# EAGLE design ttl-bob (EAGLE 6.4)
DATABASE: ../../lbr/part-db/parts-db.txt
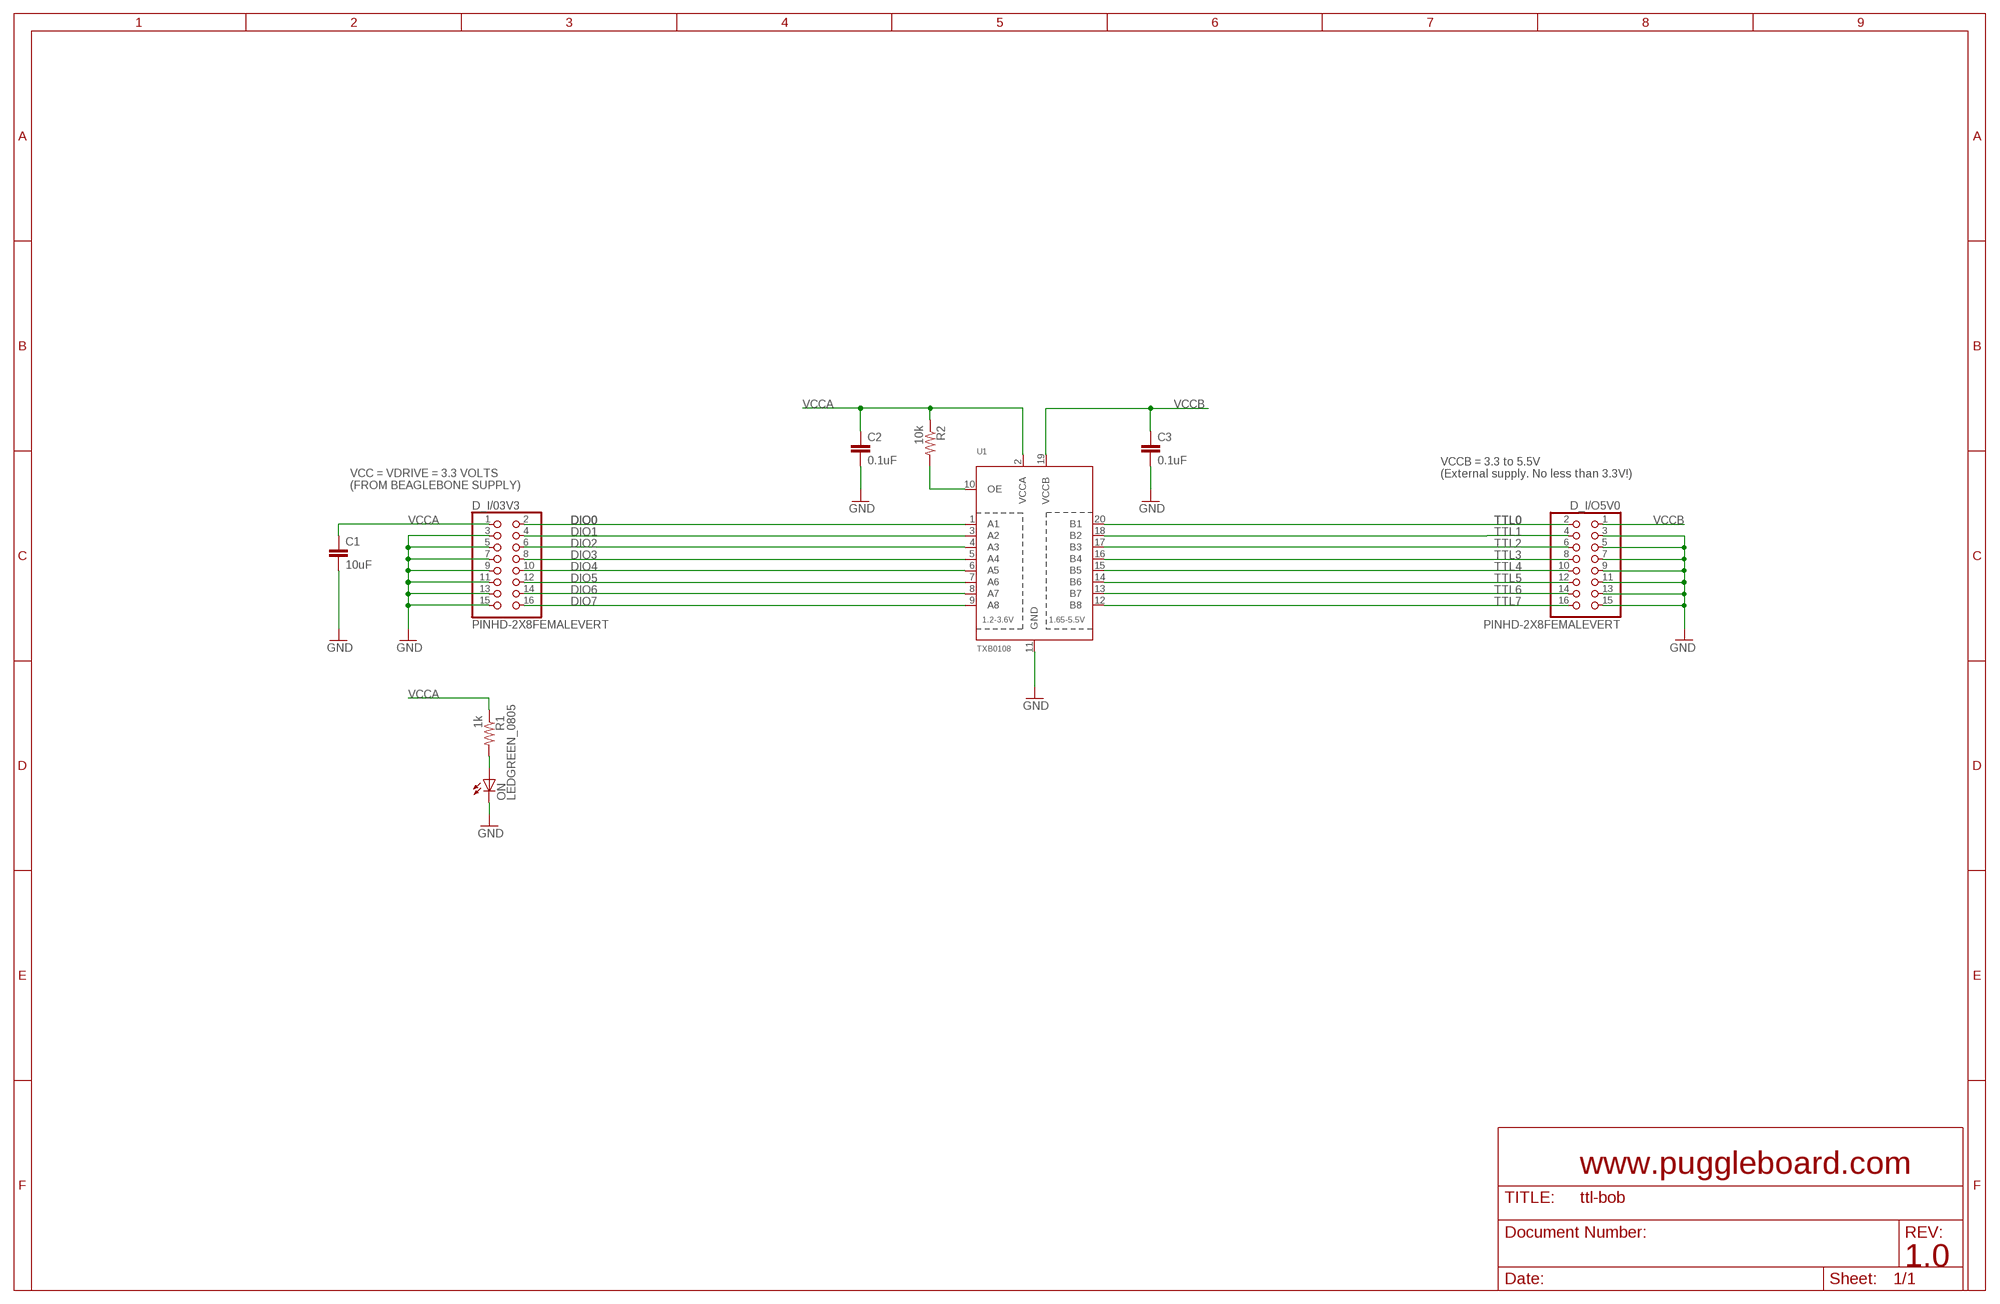
[diagram p0: schematic, sheet 1]

## Parts
C1  10uF  C_0805  [0805]
C2  0.1uF  C_0603  [0603]
C3  0.1uF  C_0603  [0603]
D_I/03V3  PINHD-2X8FEMALEVERT  [2X08]
D_I/O5V0  PINHD-2X8FEMALEVERT  [2X08]
ON  LEDGREEN_0805  [CHIP-LED0805]
R1  1k  R_0603  [0603]
R2  10k  R_0603  [0603]
U1  TXB0108  TXB0108PWR  [TSSOP20]

## Nets
DIO0: D_I/03V3.2 U1.1(A1)
DIO1: D_I/03V3.4 U1.3(A2)
DIO2: D_I/03V3.6 U1.4(A3)
DIO3: D_I/03V3.8 U1.5(A4)
DIO4: D_I/03V3.10 U1.6(A5)
DIO5: D_I/03V3.12 U1.7(A6)
DIO6: D_I/03V3.14 U1.8(A7)
DIO7: D_I/03V3.16 U1.9(A8)
GND [gnd]: C1.2 C2.2 C3.2 D_I/03V3.3 D_I/03V3.5 D_I/03V3.7 D_I/03V3.9 D_I/03V3.11 D_I/03V3.13 D_I/03V3.15 D_I/O5V0.3 D_I/O5V0.5 D_I/O5V0.7 D_I/O5V0.9 D_I/O5V0.11 D_I/O5V0.13 D_I/O5V0.15 ON.C U1.11(GND)
N$7: R2.2 U1.10(OE)
N$9: ON.A R1.2
TTL0: D_I/O5V0.2 U1.20(B1)
TTL1: D_I/O5V0.4 U1.18(B2)
TTL2: D_I/O5V0.6 U1.17(B3)
TTL3: D_I/O5V0.8 U1.16(B4)
TTL4: D_I/O5V0.10 U1.15(B5)
TTL5: D_I/O5V0.12 U1.14(B6)
TTL6: D_I/O5V0.14 U1.13(B7)
TTL7: D_I/O5V0.16 U1.12(B8)
VCCA [supply]: C1.1 C2.1 D_I/03V3.1 R1.1 R2.1 U1.2(VCCA)
VCCB [supply]: C3.1 D_I/O5V0.1 U1.19(VCCB)

## Notes on the sheet
- VCCB = 3.3 to 5.5V
  (External supply. No less than 3.3V!)
- VCC = VDRIVE = 3.3 VOLTS 
  (FROM BEAGLEBONE SUPPLY)
- www.puggleboard.com
- 1.0

## Library data of the parts
C1 = puggleboard:C: Capacitor; MN: TDK Corp.; PARTNO: C2012X5R1Cxxxxxxx; VID: DK
C2 C3 = puggleboard:C: Capacitor
D_I/03V3 D_I/O5V0 = puggleboard:PINHD-2X8; DK: S7111-ND; MN: Sullins; MPN: PPPC082LFBN-RC
ON = puggleboard:LED; DK: 350-2044-1-ND; MN: 598-8170-107F; MPN: Dialight
R1 = puggleboard:R: Resistor; DK: P1.00KHCT-ND; MN: Panasonic; MPN: ERJ-3EKF1001V
R2 = puggleboard:R: Resistor; DK: P10.0KHCT-ND; MN: Panasonic; MPN: ERJ-3EKF1002V
U1 = puggleboard:TXB0108PWR: 8-Bit Bi-Directional Level Shifter 1.2V-3.6V (VCCA) to 1.65V-5.5V (VCCB) bi-directional level shifter with auto direction sensing. Max data rate - VCCA 1.8V: 20Mbps (50ns), VCCA 3.3V: 100Mbps (10ns) Digikey: 296-21527-1-ND; DK: 296-21527-1-ND; MN: Texas Instruments; MPN: TXB0108PWR

## Net classes
1 supply: width 0.254 mm
2 diffpair: width 0.178 mm
3 gnd: width 0.254 mm

## Board
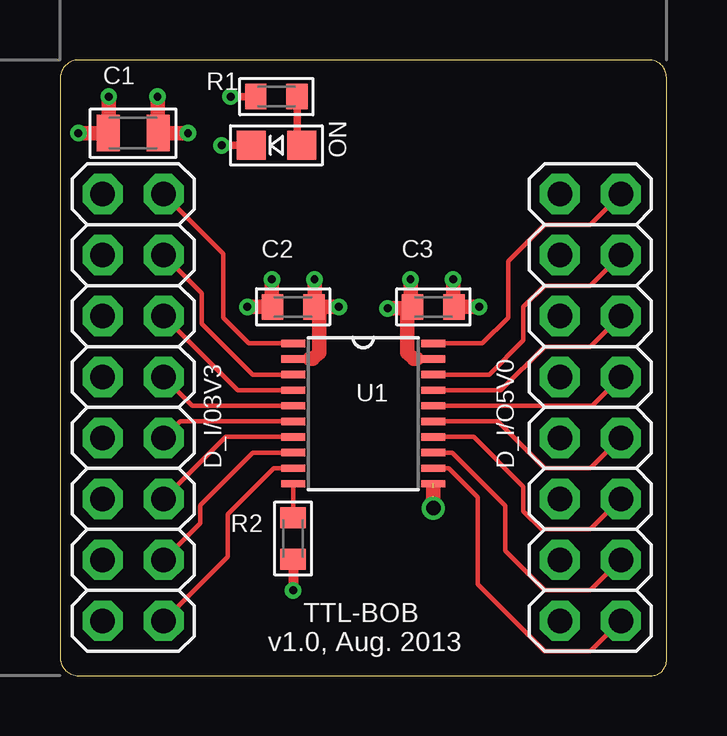
[diagram p1: board, top side]
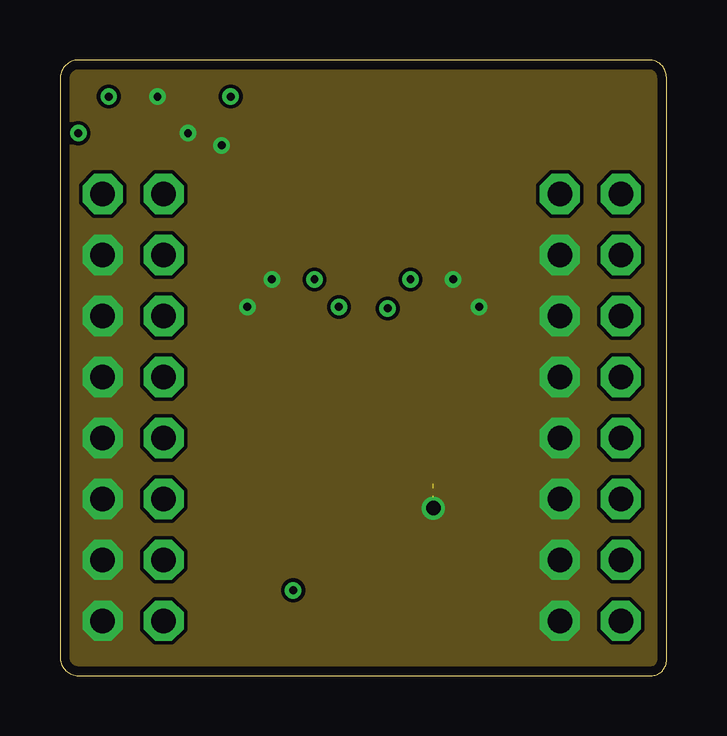
[diagram p2: board, inner layer Ground]
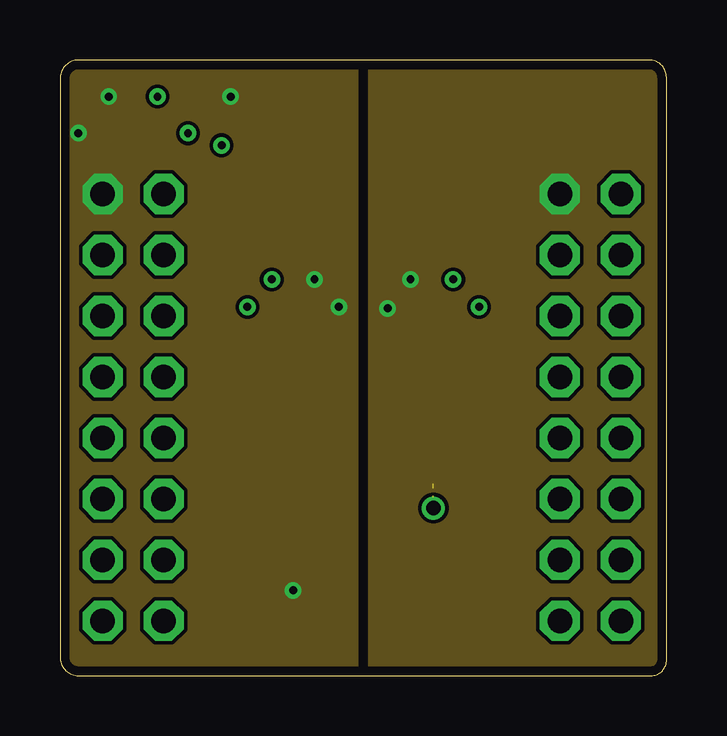
[diagram p3: board, inner layer Supply]
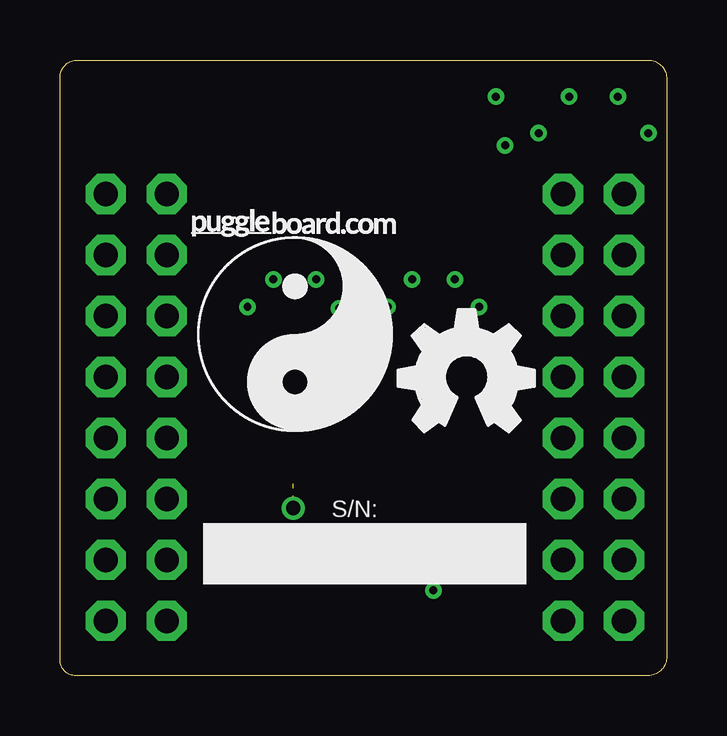
[diagram p4: board, bottom side, seen from below]

Size 25.28 x 25.66 mm. Coordinates in mm from the lower left corner, seen from the top.
Outline: 0,24.85 0,0.72 arc90 0.84,0 24.68,0 arc90 25.27,0.72 25.27,24.94 arc90 24.55,25.66 0.76,25.66 arc90 0,24.85
Copper layers (1+2*15+16): Top 0.0356mm / dielectric 1.5011mm / Ground 0.0356mm / dielectric 0.1499mm / Supply 0.0356mm / dielectric 0.2007mm / Bottom 0.0356mm
Design rules "ohs-park-mod": minimum track width 6mil, minimum drill 13mil, track to track 6mil, track to pad 6mil, pad to pad 6mil, via to via 6mil, smd to smd 6mil, copper to edge 15mil, drill to drill 6mil, minimum pad ring 7mil, minimum via ring 7mil, stop-mask expansion 4mil, vias tented up to drill 15mil, thermal gap 10mil

### Footprints (pad centres in the part's own frame; a part is rotated, then mirrored left to right if it is on the bottom)
0805 = smd 0.965 x 1.524: 1 -1.041,0; 2 1.041,0
0603 = smd 0.889 x 1.067: 1 -0.864,0; 2 0.864,0
2X08 = drill 1.016 pad 1.676 octagon: 1 -8.89,-1.27; 2 -8.89,1.27; 3 -6.35,-1.27; 4 -6.35,1.27; 5 -3.81,-1.27; 6 -3.81,1.27; 7 -1.27,-1.27; 8 -1.27,1.27; 9 1.27,-1.27; 10 1.27,1.27; 11 3.81,-1.27; 12 3.81,1.27; 13 6.35,-1.27; 14 6.35,1.27; 15 8.89,-1.27; 16 8.89,1.27
CHIP-LED0805 = smd 1.2 x 1.2: A 0,-1.05; C 0,1.05
TSSOP20 = smd 0.305 x 0.991: 1 -2.925,-2.918; 2 -2.275,-2.918; 3 -1.625,-2.918; 4 -0.975,-2.918; 5 -0.325,-2.918; 6 0.325,-2.918; 7 0.975,-2.918; 8 1.625,-2.918; 9 2.275,-2.918; 10 2.925,-2.918; 11 2.925,2.918; 12 2.275,2.918; 13 1.625,2.918; 14 0.975,2.918; 15 0.325,2.918; 16 -0.325,2.918; 17 -0.975,2.918; 18 -1.625,2.918; 19 -2.275,2.918; 20 -2.925,2.918

### Placement (x,y rotation side)
C1  3.05,22.61 0 top
C2  9.72,15.37 180 top
C3  15.56,15.37 0 top
D_I/03V3  3.05,11.18 270 top
D_I/O5V0  22.1,11.18 270 top
ON  9.02,22.1 90 top
R1  9.02,24.13 0 top
R2  9.72,5.72 90 top
U1  12.64,10.92 270 top
U$1  [PB-LOGO]  19.81,10.16 0 bottom
U$2  [OSHW_FILLX200_NOTEXT]  11.18,10.16 0 bottom

### Tracks (layer width: path | path; a pad name or v marks a point on that pad's centre or on a via)
DIO0
  Top 0.178: D_I/03V3.2 6.79,17.59 6.79,14.92 7.87,13.85 U1.1
DIO1
  Top 0.178: D_I/03V3.4 5.91,15.94 5.91,14.67 8.03,12.55 U1.3
DIO2
  Top 0.178: D_I/03V3.6 7.41,11.9 U1.4
DIO3
  Top 0.178: D_I/03V3.8 5.52,11.25 U1.5
DIO4
  Top 0.178: D_I/03V3.10 5.01,10.6 U1.6
DIO5
  Top 0.178: D_I/03V3.12 6.9,9.95 U1.7
DIO6
  Top 0.178: D_I/03V3.14 5.84,6.35 5.84,7.11 8.03,9.3 8.79,9.3 U1.8
DIO7
  Top 0.178: D_I/03V3.16 6.99,4.96 6.99,6.73 8.9,8.65 U1.9
GND  (via drill 0.33, 0.6)  (2 unrouted)
  Top 0.305: ON.C v6.73,22.1
  Top 0.61: C1.2 v5.33,22.61 | v4.06,24.13 4.06,22.61 | v7.81,15.37 8.83,15.37 | 8.83,15.37 C2.2 | v8.83,16.51 8.83,15.37 | v16.38,16.51 16.38,15.37 | v17.46,15.37 C3.2 | v15.56,6.99 15.56,7.43 | 15.56,7.5 15.56,7.81
  pour Ground (no thermals): 0,25.66 0,0 25.27,0 25.27,25.66
N$7
  Top 0.178: R2.2 U1.10
N$9
  Top 0.305: R1.2 9.88,22.29 ON.A
TTL0
  Top 0.178: D_I/O5V0.2 22.1,18.8 20.19,18.8 18.67,17.27 18.67,14.92 17.59,13.85 U1.20
TTL1
  Top 0.178: D_I/O5V0.4 22.1,16.26 20.19,16.26 19.3,15.37 19.3,13.97 17.88,12.55 U1.18
TTL2
  Top 0.178: D_I/O5V0.6 22.1,13.72 20.19,13.72 18.37,11.9 U1.17
TTL3
  Top 0.178: D_I/O5V0.8 22.17,11.25 U1.16
TTL4
  Top 0.178: D_I/O5V0.10 22.1,8.64 20.19,8.64 18.23,10.6 U1.15
TTL5
  Top 0.178: D_I/O5V0.12 22.1,6.1 20.07,6.1 19.3,6.86 19.3,7.88 17.23,9.95 U1.14
TTL6
  Top 0.178: D_I/O5V0.14 22.1,3.56 20.19,3.56 18.54,5.21 18.54,7.09 16.34,9.3 U1.13
TTL7
  Top 0.178: D_I/O5V0.16 22.1,1.02 20.19,1.02 17.4,3.81 17.4,7.43 16.19,8.64 15.56,8.64 U1.12
VCCA  (via drill 0.33)
  Top 0.254: 10.41,13.21 U1.2 | 7.62,24.13 R1.1
  Top 0.305: v7.11,24.13 R1.1
  Top 0.406: R2.1 v9.72,3.56
  Top 0.61: v0.76,22.61 C1.1 2.03,22.63 v2.03,24.13 | 10.41,13.21 10.54,13.21 10.79,13.46 10.79,15.15 C2.1 10.6,15.37 | v11.62,15.37 10.6,15.37 | v10.6,16.51 10.6,15.37
  pour Supply (no thermals): 0,25.66 0,0 12.32,0 12.32,25.66
VCCB  (via drill 0.33)
  Top 0.254: 14.86,13.21 14.87,13.2 U1.19
  Top 0.61: 14.86,13.21 14.73,13.21 14.48,13.46 14.48,15.15 C3.1 14.63,15.31 v13.65,15.31 | v14.61,16.51 14.61,15.31
  pour Supply (no thermals): 12.95,25.66 12.95,0 25.27,0 25.27,25.66

### Text on the board
tPlace: TTL-BOB / v1.0, Aug. 2013
bPlace: S/N: